# Altium schematic sheet ADC_schematic.SchDoc
size A4
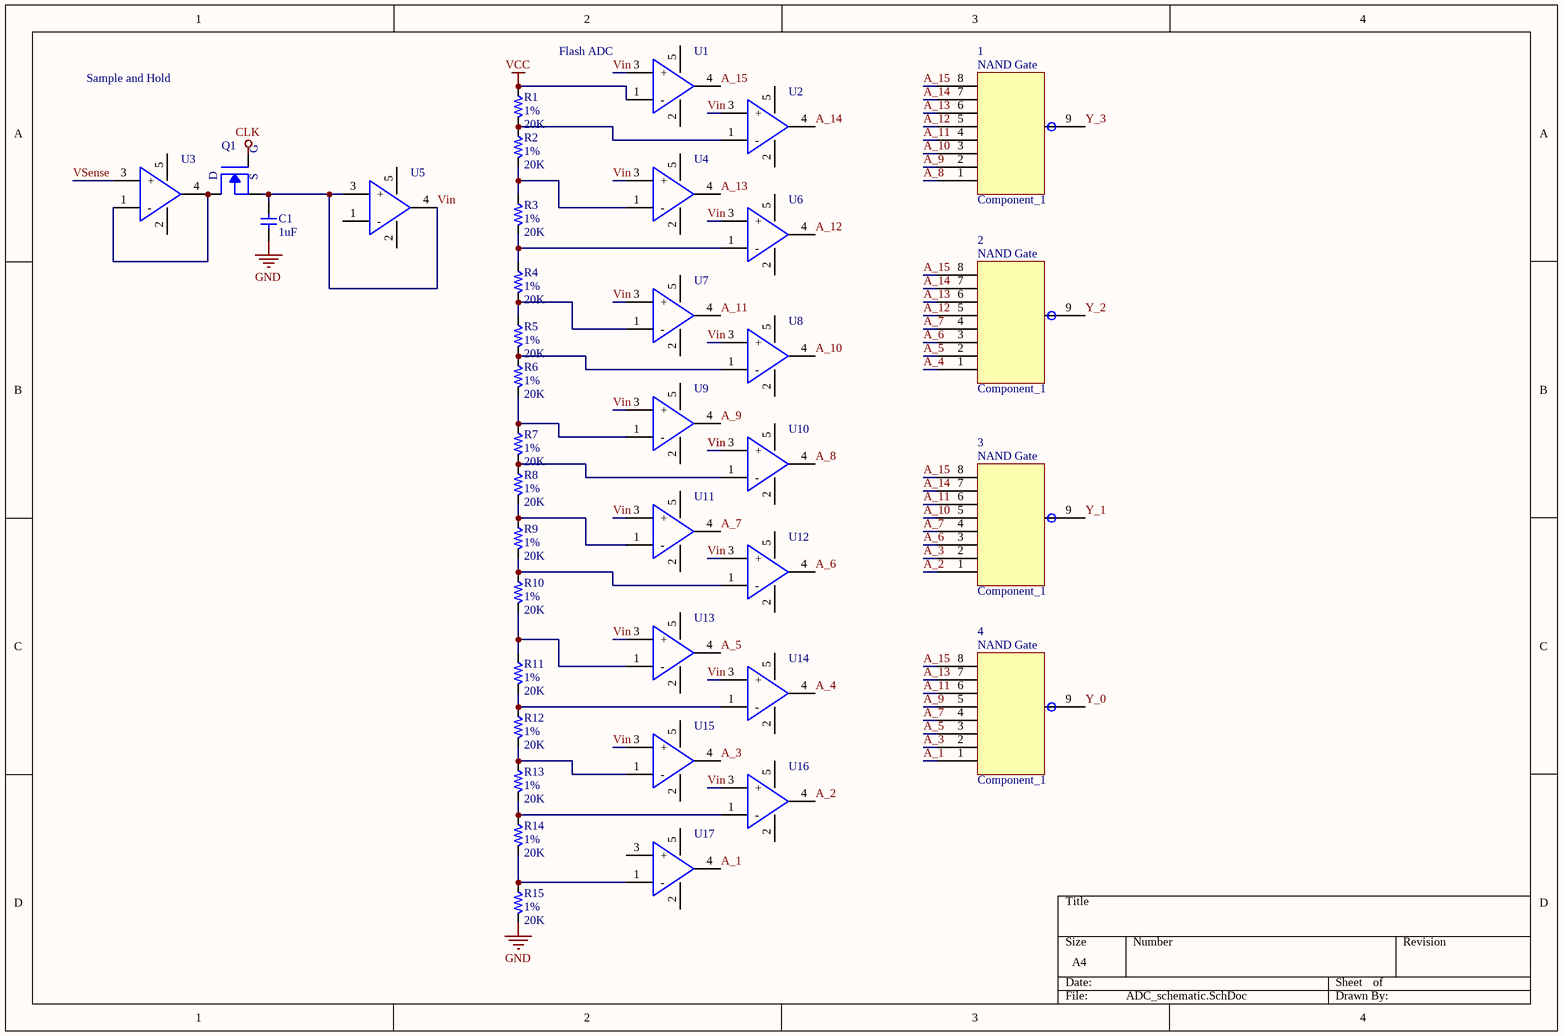
[diagram p0: ADC_schematic.SchDoc]

## Parts
1  Component_1
2  Component_1
3  Component_1
4  Component_1
C1  value 1uF  [PCB_GENERIC_SMD_0603]  (hidden comment: C060-0001U-00)
Q1  NMOS - SSM3K333R  [NMOS - SSM3K333R - SOTFL95P180X88-3M]  (value not drawn)
R1  value 20K  Tolerance: 1%  [PCB_GENERIC_SMD_0603]  (hidden comment: R060-00103-01)
R2  value 20K  Tolerance: 1%  [PCB_GENERIC_SMD_0603]  (hidden comment: R060-00103-01)
R3  value 20K  Tolerance: 1%  [PCB_GENERIC_SMD_0603]  (hidden comment: R060-00103-01)
R4  value 20K  Tolerance: 1%  [PCB_GENERIC_SMD_0603]  (hidden comment: R060-00103-01)
R5  value 20K  Tolerance: 1%  [PCB_GENERIC_SMD_0603]  (hidden comment: R060-00103-01)
R6  value 20K  Tolerance: 1%  [PCB_GENERIC_SMD_0603]  (hidden comment: R060-00103-01)
R7  value 20K  Tolerance: 1%  [PCB_GENERIC_SMD_0603]  (hidden comment: R060-00103-01)
R8  value 20K  Tolerance: 1%  [PCB_GENERIC_SMD_0603]  (hidden comment: R060-00103-01)
R9  value 20K  Tolerance: 1%  [PCB_GENERIC_SMD_0603]  (hidden comment: R060-00103-01)
R10  value 20K  Tolerance: 1%  [PCB_GENERIC_SMD_0603]  (hidden comment: R060-00103-01)
R11  value 20K  Tolerance: 1%  [PCB_GENERIC_SMD_0603]  (hidden comment: R060-00103-01)
R12  value 20K  Tolerance: 1%  [PCB_GENERIC_SMD_0603]  (hidden comment: R060-00103-01)
R13  value 20K  Tolerance: 1%  [PCB_GENERIC_SMD_0603]  (hidden comment: R060-00103-01)
R14  value 20K  Tolerance: 1%  [PCB_GENERIC_SMD_0603]  (hidden comment: R060-00103-01)
R15  value 20K  Tolerance: 1%  [PCB_GENERIC_SMD_0603]  (hidden comment: R060-00103-01)
U1  AP331A  [SOT95P285X130-5N]  (value not drawn)
U2  AP331A  [SOT95P285X130-5N]  (value not drawn)
U3  AP331A  [SOT95P285X130-5N]  (value not drawn)
U4  AP331A  [SOT95P285X130-5N]  (value not drawn)
U5  AP331A  [SOT95P285X130-5N]  (value not drawn)
U6  AP331A  [SOT95P285X130-5N]  (value not drawn)
U7  AP331A  [SOT95P285X130-5N]  (value not drawn)
U8  AP331A  [SOT95P285X130-5N]  (value not drawn)
U9  AP331A  [SOT95P285X130-5N]  (value not drawn)
U10  AP331A  [SOT95P285X130-5N]  (value not drawn)
U11  AP331A  [SOT95P285X130-5N]  (value not drawn)
U12  AP331A  [SOT95P285X130-5N]  (value not drawn)
U13  AP331A  [SOT95P285X130-5N]  (value not drawn)
U14  AP331A  [SOT95P285X130-5N]  (value not drawn)
U15  AP331A  [SOT95P285X130-5N]  (value not drawn)
U16  AP331A  [SOT95P285X130-5N]  (value not drawn)
U17  AP331A  [SOT95P285X130-5N]  (value not drawn)

## Nets
CLK: Q1.1(G)
GND: C1.1 R15.2
VCC: R1.1 U1.1(-)
A_1: 4.1 U17.4(VOUT)
A_2: 3.1 U16.4(VOUT)
A_3: 3.2 4.2 U15.4(VOUT)
A_4: 2.1 U14.4(VOUT)
A_5: 2.2 4.3 U13.4(VOUT)
A_6: 2.3 3.3 U12.4(VOUT)
A_7: 2.4 3.4 4.4 U11.4(VOUT)
A_8: 1.1 U10.4(VOUT)
A_9: 1.2 4.5 U9.4(VOUT)
A_10: 1.3 3.5 U8.4(VOUT)
A_11: 1.4 3.6 4.6 U7.4(VOUT)
A_12: 1.5 2.5 U6.4(VOUT)
A_13: 1.6 2.6 4.7 U4.4(VOUT)
A_14: 1.7 2.7 3.7 U2.4(VOUT)
A_15: 1.8 2.8 3.8 4.8 U1.4(VOUT)
Vin: C1.2 Q1.2(S) U1.3(+) U2.3(+) U4.3(+) U5.3(+) U5.4(VOUT) U6.3(+) U7.3(+) U8.3(+) U9.3(+) U10.3(+) U11.3(+) U12.3(+) U13.3(+) U14.3(+) U15.3(+) U16.3(+)
VSense: U3.3(+)
NetQ1_3: Q1.3(D) U3.1(-) U3.4(VOUT)
NetR1_2: R1.2 R2.1 U2.1(-)
NetR2_2: R2.2 R3.1 U4.1(-)
NetR3_2: R3.2 R4.1 U6.1(-)
NetR4_2: R4.2 R5.1 U7.1(-)
NetR5_2: R5.2 R6.1 U8.1(-)
NetR6_2: R6.2 R7.1 U9.1(-)
NetR7_2: R7.2 R8.1 U10.1(-)
NetR8_2: R8.2 R9.1 U11.1(-)
NetR9_2: R9.2 R10.1 U12.1(-)
NetR10_2: R10.2 R11.1 U13.1(-)
NetR11_2: R11.2 R12.1 U14.1(-)
NetR12_2: R12.2 R13.1 U15.1(-)
NetR13_2: R13.2 R14.1 U16.1(-)
NetR14_2: R14.2 R15.1 U17.1(-)

Not connected (* = marked no-connect by the designer): 1 9; 2 9; 3 9; 4 9; U1 2(GND) 5(VCC); U2 2(GND) 5(VCC); U3 2(GND) 5(VCC); U4 2(GND) 5(VCC); U5 1(-) 2(GND) 5(VCC); U6 2(GND) 5(VCC); U7 2(GND) 5(VCC); U8 2(GND) 5(VCC); U9 2(GND) 5(VCC); U10 2(GND) 5(VCC); U11 2(GND) 5(VCC); U12 2(GND) 5(VCC); U13 2(GND) 5(VCC); U14 2(GND) 5(VCC); U15 2(GND) 5(VCC); U16 2(GND) 5(VCC); U17 2(GND) 3(+) 5(VCC)

## Notes on the sheet
- Sample and Hold
- Flash ADC
- Labels drawn without touching a wire or pin: Y_0, Y_1, Y_2, Y_3
- (in symbol Component_1) NAND Gate

## Library data of the parts
C1 = C060-0001U-00: CAP CER 0603 1uF 16V X5R 20%; Tolerance: 20%; Voltage: 16V; Package: 0603
Q1 = NMOS - SSM3K333R: MOSFET N CH 30V 6A 2-3Z1A; Supplier 1: Digi-Key; Supplier Part Number 1: SSM3K333RLFDKR-ND
R1-R15 = R060-00103-01: RES 0603 10K 1% 100mW; Power: 100mW; Package: 0603
U1-U17 = AP331A: Single Channel Comparator, Open Drain, SC-74A/SOT-753; Supplier 1: Digikey; Supplier Part Number 1: AP331AWGDICT-ND